# EAGLE schematic STM32F3logbord (EAGLE 9.6.2)
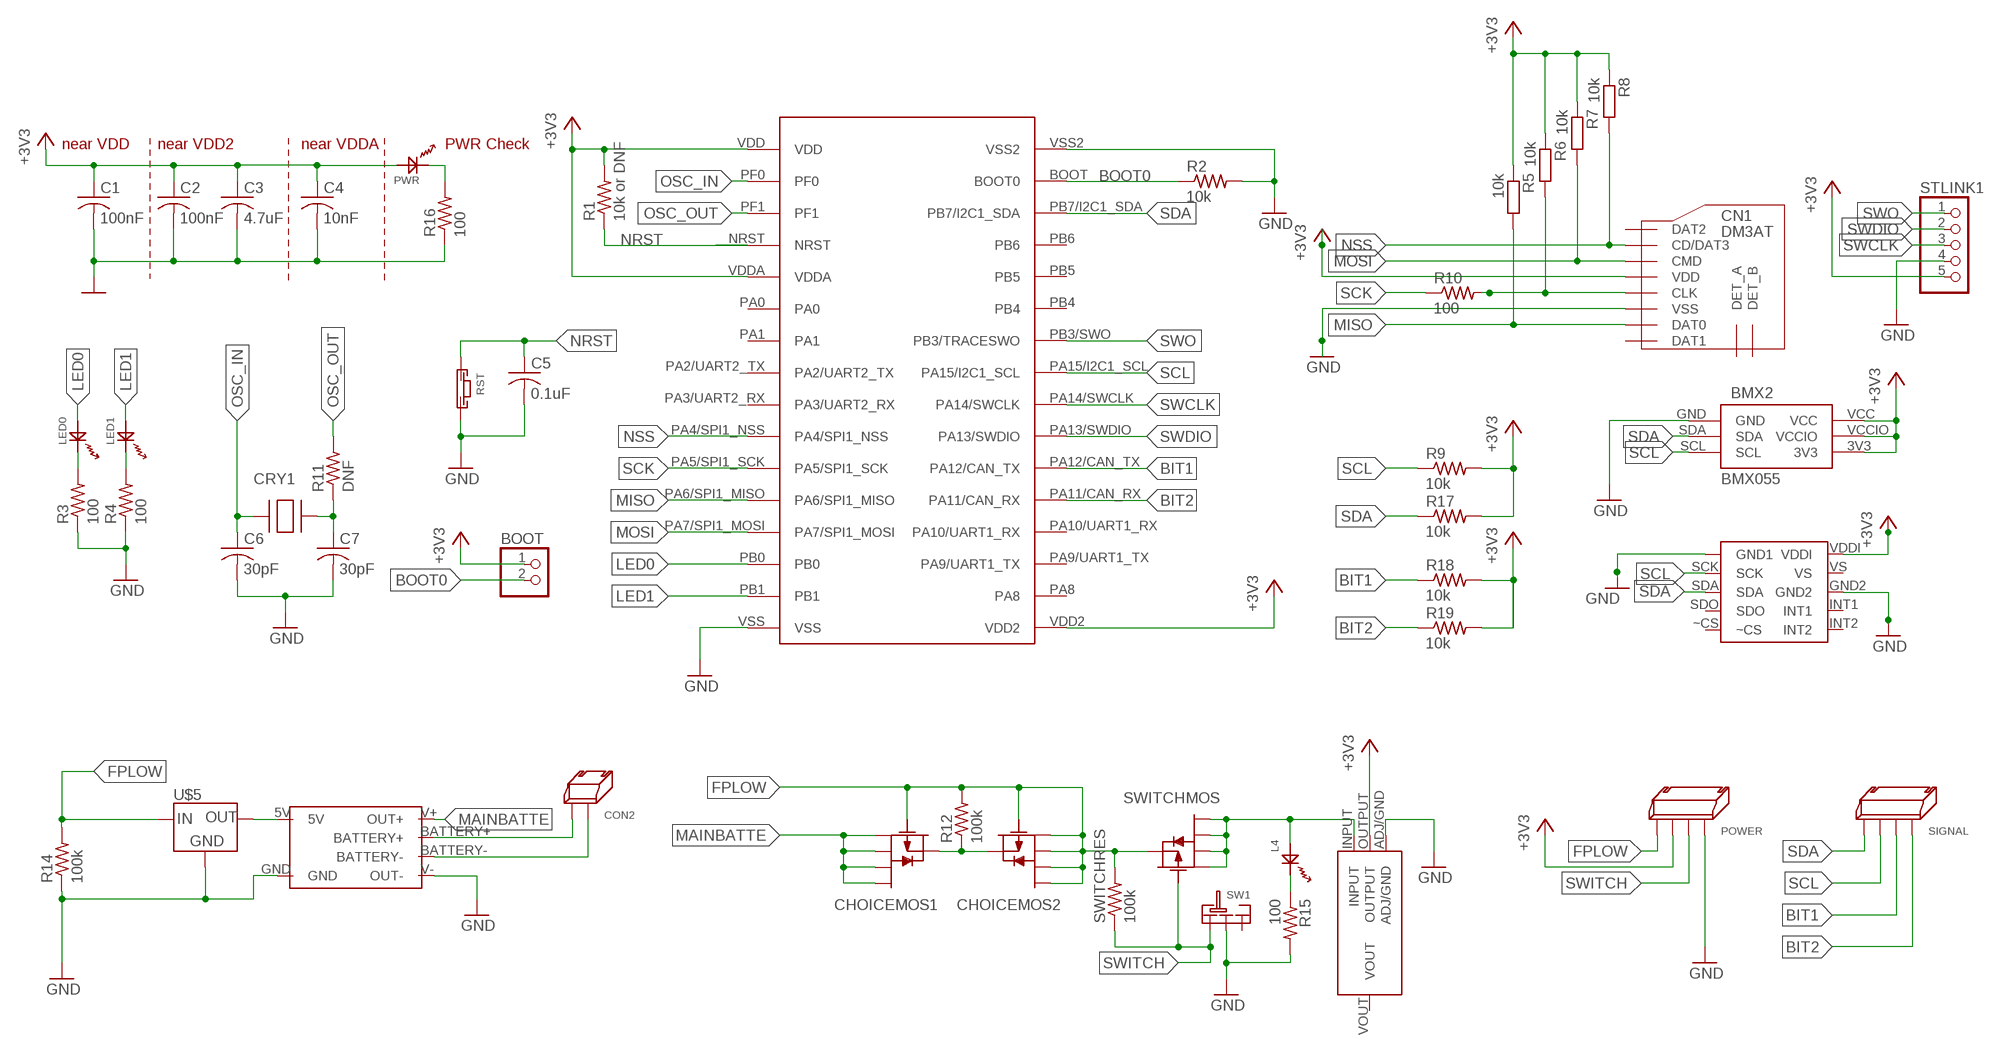
[diagram p0: schematic, sheet 1]

## Parts
BMX2  BMX055  [BMX055]
BOOT  PINHD-1X2/90  [1X02/90]
C1  100nF  C-USC1608  [C1608]
C2  100nF  C-USC1608  [C1608]
C3  4.7uF  C-USC1608  [C1608]
C4  10nF  C-USC1608  [C1608]
C5  0.1uF  C-USC1608  [C1608]
C6  30pF  C-USC1608  [C1608]
C7  30pF  C-USC1608  [C1608]
CHOICEMOS1  PCH_SSM6J808R  [SSM6J808R]
CHOICEMOS2  PCH_SSM6J808R  [SSM6J808R]
CN1  DM3AT  [DM3AT]
CON2  2PIN_SIDE  [2PIN_SIDE]
CRY1  8MHZ  [CRYSTAL]
L4  OSXX1608C1A  [OSXX1608C1A]
LED0  OSXX1608C1A  [OSXX1608C1A]
LED1  OSXX1608C1A  [OSXX1608C1A]
POWER  4PIN_SIDE  [4PIN_SIDE]
PWR  OSXX1608C1A  [OSXX1608C1A]
R1  10k or DNF  R-US_R0603  [R0603]
R2  10k  R-US_R0603  [R0603]
R3  100  R-US_R0603  [R0603]
R4  100  R-US_R0603  [R0603]
R5  10k  R-EU_R0603  [R0603]
R6  10k  R-EU_R0603  [R0603]
R7  10k  R-EU_R0603  [R0603]
R8  10k  R-EU_R0603  [R0603]
R9  10k  R-US_R0603  [R0603]
R10  100  R-US_R0603  [R0603]
R11  DNF  R-US_R0603  [R0603]
R12  100k  R-US_R0603  [R0603]
R14  100k  R-US_R0603  [R0603]
R15  100  R-US_R0603  [R0603]
R16  100  R-US_R0603  [R0603]
R17  10k  R-US_R0603  [R0603]
R18  10k  R-US_R0603  [R0603]
R19  10k  R-US_R0603  [R0603]
RST  TVAF06-A020B-R  [TVAF06-A020B-R]
SIGNAL  4PIN_SIDE  [4PIN_SIDE]
STLINK1  PINHD-1X5/90  [1X05/90]
SW1  SRIDE_SWITCH  [SRIDE_SWITCH]
SWITCHMOS  PCH_SSM6J808R  [SSM6J808R]
SWITCHRES  100k  R-US_R0603  [R0603]
U$1  STM32F303K8  [STM32F303K8]
U$2  ADXL375  [ADXL375]
U$4  AZ1117C  [AZ1117C]
U$5  LT1117-5  [SOT-223]
U$6  TP5046_MODULE  [TP4056_MODULE]

## Nets
+3V3: BMX2.3V3 BMX2.VCC BMX2.VCCIO BOOT.1 C1.1 C2.1 C3.1 C4.1 CN1.VDD PWR.AN R1.2 R5.1 R6.1 R7.1 R8.1 R9.2 R17.2 STLINK1.5 U$1.VDD U$1.VDD2 U$1.VDDA U$2.VDDI U$4.OUTPUT
BIT1: R18.1 SIGNAL.P$3 U$1.PA12/CAN_TX
BIT2: R19.1 SIGNAL.P$4 U$1.PA11/CAN_RX
BOOT0: BOOT.2 R2.1 U$1.BOOT(BOOT0)
FPLOW: CHOICEMOS1.3 CHOICEMOS2.1 CHOICEMOS2.2 CHOICEMOS2.3 CHOICEMOS2.5 CHOICEMOS2.6 POWER.P$2 R12.2 R14.2 SWITCHMOS.4 SWITCHRES.2 U$5.3(IN)
GND: BMX2.GND C1.2 C2.2 C3.2 C4.2 C5.2 C6.2 C7.2 CN1.VSS POWER.P$4 R2.2 R3.1 R4.1 R14.1 R15.2 R16.1 RST.P$2 STLINK1.4 SW1.LR U$1.VSS U$1.VSS2 U$2.GND1 U$2.GND2 U$4.ADJ/GND U$5.4(GND) U$6.GND U$6.V-(OUT-)
LED0: LED0.AN U$1.PB0
LED1: LED1.AN U$1.PB1
MAINBATTE: CHOICEMOS1.1 CHOICEMOS1.2 CHOICEMOS1.5 CHOICEMOS1.6 U$6.V+(OUT+)
MISO: CN1.DAT0 R5.2 U$1.PA6/SPI1_MISO
MOSI: CN1.CMD R7.2 U$1.PA7/SPI1_MOSI
N$1: U$1.NRST
N$2: PWR.CT R16.2
N$3: LED0.CT R3.2
N$4: LED1.CT R4.2
N$5: U$5.2(OUT) U$6.5V
N$7: C7.1 CRY1.P$2 R11.1
N$8: POWER.P$1 ; supply symbol labelled +3V3
N$9: R18.2 R19.2
N$10: CHOICEMOS1.4 CHOICEMOS2.4 R12.1
N$11: L4.AN SWITCHMOS.1 SWITCHMOS.2 SWITCHMOS.5 SWITCHMOS.6 U$4.INPUT
N$12: CON2.P$2 U$6.BATTERY+
N$13: CON2.P$1 U$6.BATTERY-
N$16: L4.CT R15.1
NRST: C5.1 R1.1 RST.P$1
NSS: CN1.CD/DAT3 R8.2 U$1.PA4/SPI1_NSS
OSC_IN: C6.1 CRY1.P$1 U$1.PF0
OSC_OUT: R11.2 U$1.PF1
SCK: CN1.CLK R6.2 R10.1 R10.2 U$1.PA5/SPI1_SCK
SCL: BMX2.SCL R9.1 SIGNAL.P$1 U$1.PA15/I2C1_SCL U$2.SCK
SDA: BMX2.SDA R17.1 SIGNAL.P$2 U$1.PB7/I2C1_SDA U$2.SDA
SWCLK: STLINK1.3 U$1.PA14/SWCLK
SWDIO: STLINK1.2 U$1.PA13/SWDIO
SWITCH: POWER.P$3 SW1.L SWITCHMOS.3 SWITCHRES.1
SWO: STLINK1.1 U$1.PB3/SWO(PB3/TRACESWO)
Unconnected: CN1.DAT1 CN1.DAT2 CN1.DET_A CN1.DET_B SW1.R U$1.PA0 U$1.PA1 U$1.PA2/UART2_TX U$1.PA3/UART2_RX U$1.PA8 U$1.PA9/UART1_TX U$1.PA10/UART1_RX U$1.PB4 U$1.PB5 U$1.PB6 U$2.INT1 U$2.INT2 U$2.SDO U$2.VS U$2.~CS U$4.VOUT

## Notes on the sheet
- near VDD | near VDD2 | near VDDA | PWR Check

## Library data of the parts
BMX2 = BMX055:BMX055
BOOT = pinhead:PINHD-1X2: PIN HEADER
C1-C7 = rcl:C-US: CAPACITOR, American symbol; SPICEPREFIX: C
CHOICEMOS1 CHOICEMOS2 SWITCHMOS = Chip MOSFET:PCH_SSM6J808R
CN1 = microSD:DM3AT
CON2 = XR Connector:2PIN_SIDE
CRY1 = Crystal:8MHZ
L4 LED0 LED1 PWR = Chip LED:OSXX1608C1A
POWER SIGNAL = XR Connector:4PIN_SIDE
R1-R4 R9-R12 R14-R19 SWITCHRES = rcl:R-US_: RESISTOR, American symbol; SPICEPREFIX: R
R5-R8 = rcl:R-EU_: RESISTOR, European symbol; SPICEPREFIX: R
RST = Tact switch:TVAF06-A020B-R
STLINK1 = pinhead:PINHD-1X5: PIN HEADER
SW1 = Sride Switch:SRIDE_SWITCH
U$1 = STM32F303K8:STM32F303K8
U$2 = ADXL375:ADXL375
U$4 = AZ1117C:AZ1117C
U$5 = LT1117:LT1117-5
U$6 = TP4056_module:TP5046_MODULE